# Altium schematic sheet Main.SchDoc
size A3; SheetNumber: 3; SheetTotal: 5
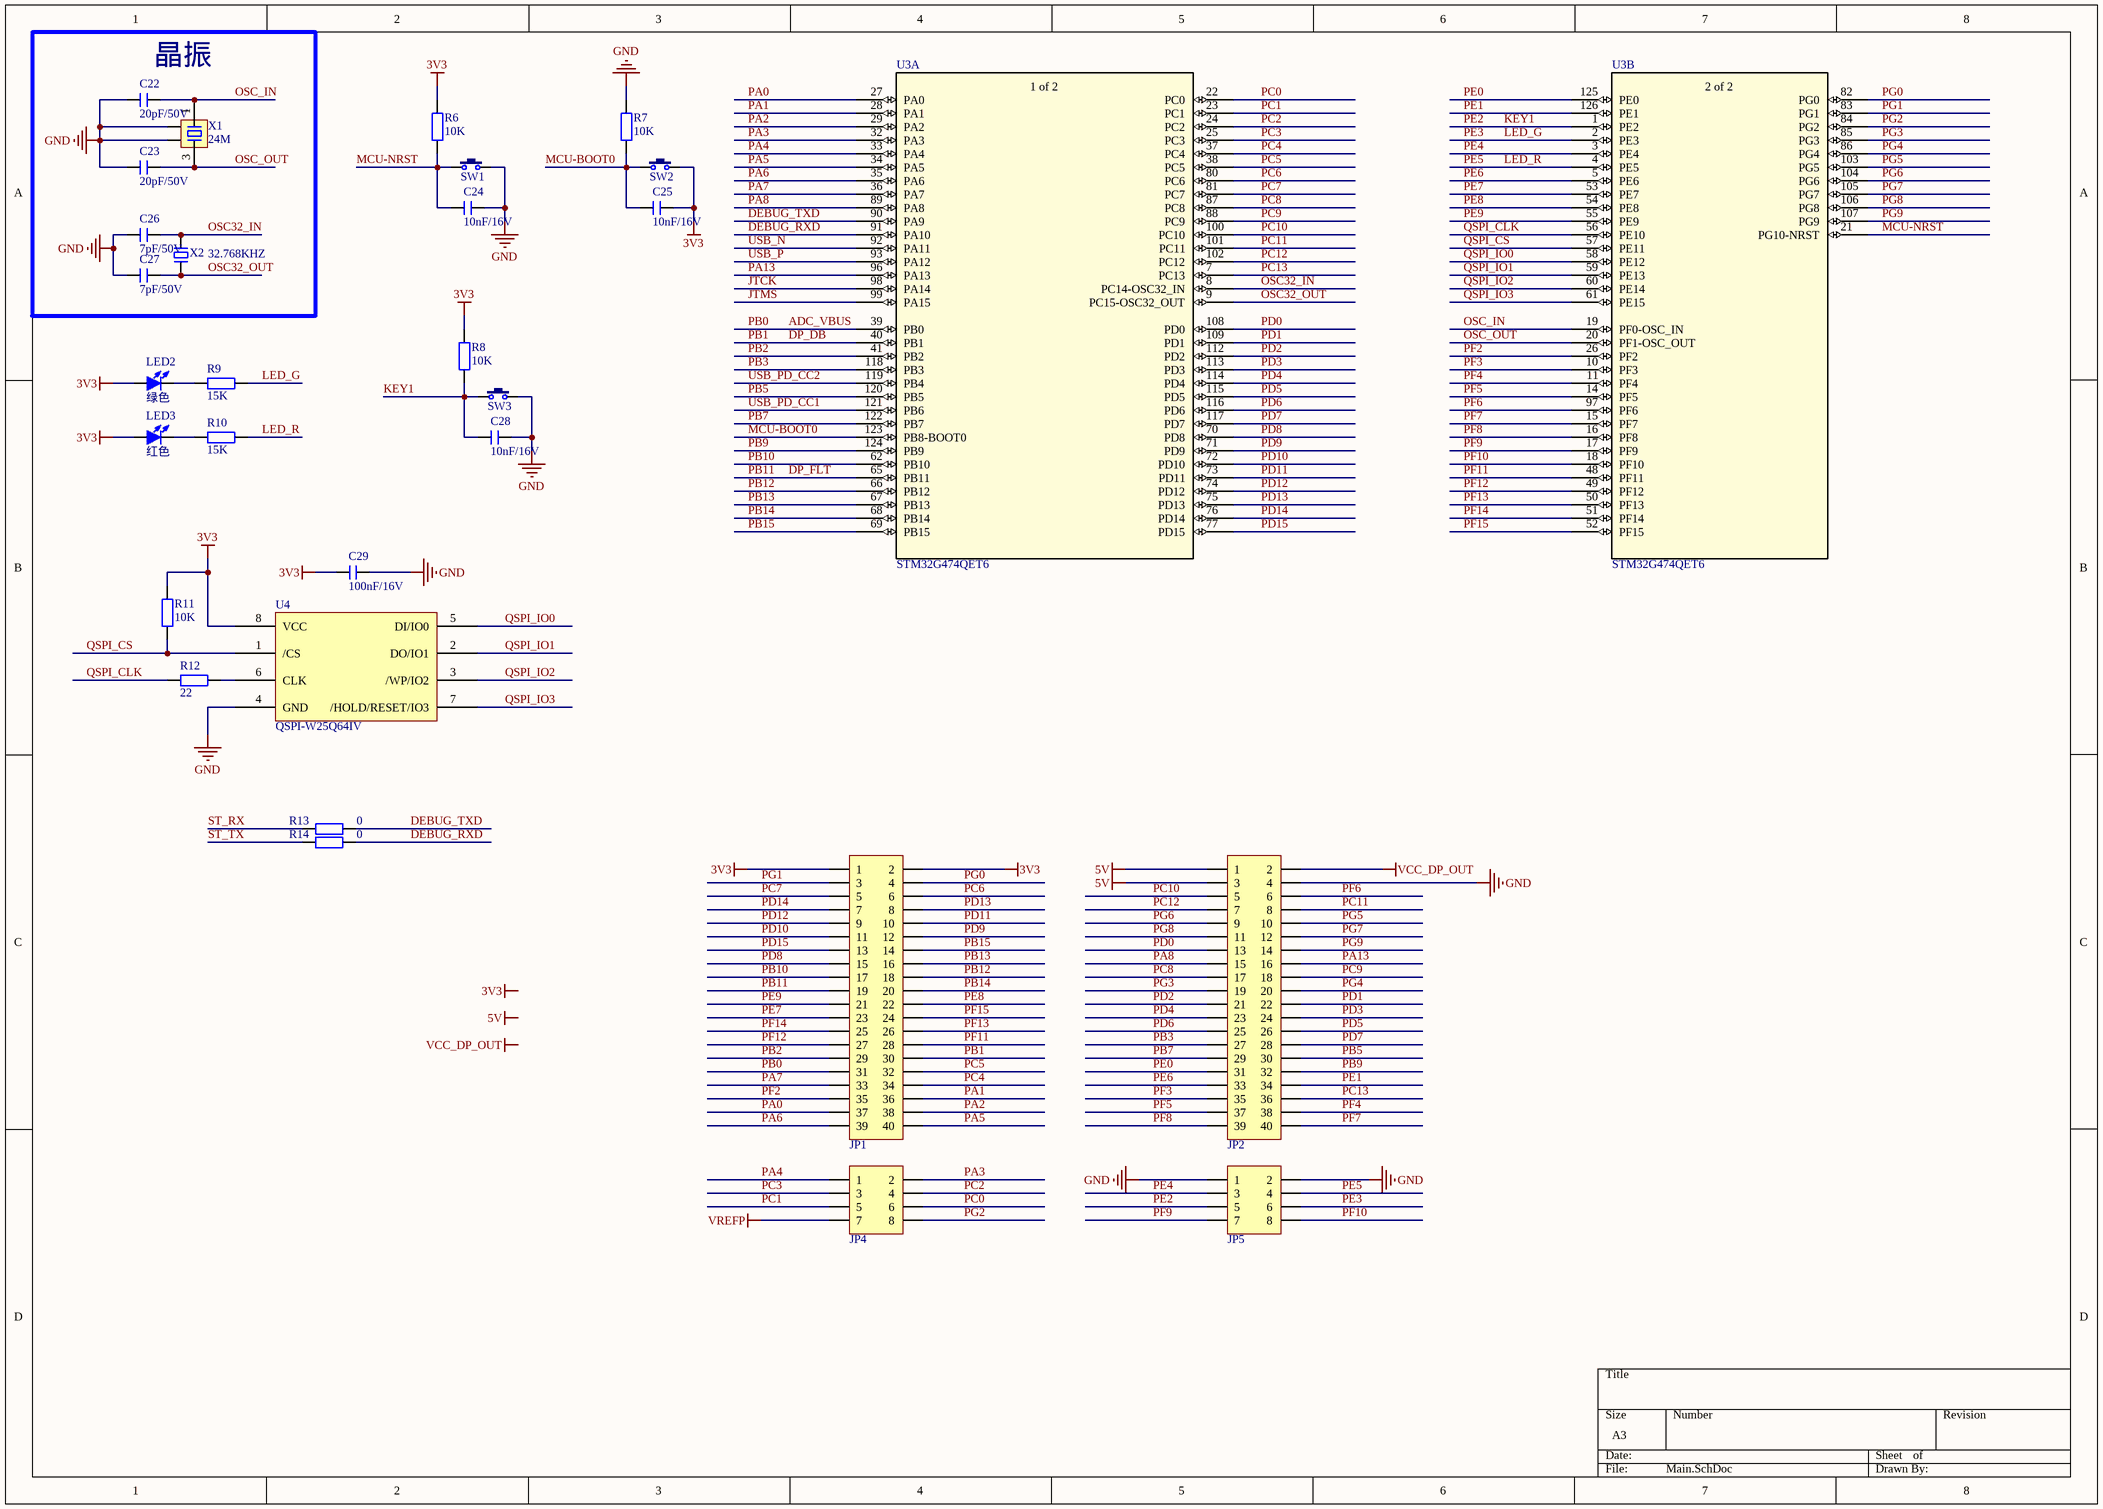
[diagram p0: Main.SchDoc]

## Parts
C22  20pF/50V  [C 0402_L]
C23  20pF/50V  [C 0402_L]
C24  10nF/16V  [C 0402_L]
C25  10nF/16V  [C 0402_L]
C26  7pF/50V  [C 0402_L]
C27  7pF/50V  [C 0402_L]
C28  10nF/16V  [C 0402_L]
C29  100nF/16V  [C 0402_L]
JP1  Header 2X11  [HDR2.54-LI-2x20P]  (value not drawn)
JP2  Header 2X11  [HDR2.54-LI-2x20P]  (value not drawn)
JP4  Header 4X2  [HDR2.54-LI-2x4P]  (value not drawn)
JP5  Header 4X2  [HDR2.54-LI-2x4P]  (value not drawn)
LED2  绿色  [LED]
LED3  红色  [LED]
R6  10K  [R 0402_L]
R7  10K  [R 0402_L]
R8  10K  [R 0402_L]
R9  15K  [R 0402_L]
R10  15K  [R 0402_L]
R11  10K  [R 0402_L]
R12  22  [R 0402_L]
R13  0  [R 0402_L]
R14  0  [R 0402_L]
SW1  3x6x5  [按钮]  (value not drawn)
SW2  3x6x5  [按钮]  (value not drawn)
SW3  3x6x5  [按钮]  (value not drawn)
U3  STM32G474QET6  [LQFP128-14*14]  (parts A,B of 3)
U4  QSPI-W25Q64IV  [SOP8]
X1  24M  [OSC 3225-4P]
X2  32.768KHZ  [OSC 3215-2P]

## Blocks framed on the sheet
晶振: C22 C23 C26 C27 X1 X2

## Nets
3V3: C25.2 C29.2 JP1.1 JP1.2 LED2.1(A) LED3.1(A) R6.2 R8.2 R11.1 SW2.2 U4.8(VCC)
5V: JP2.1 JP2.3
GND: C22.1 C23.1 C24.2 C26.1 C27.1 C28.2 C29.1 JP2.4 JP5.1 JP5.2 R7.2 SW1.2 SW3.2 U4.4(GND) X1.2 X1.4
VCC_DP_OUT: JP2.2
VREFP: JP4.7
ADC_VBUS: JP1.31 U3.39(PB0)  [also labelled PB0]
DEBUG_RXD: R14.2 U3.91(PA10)
DEBUG_TXD: R13.2 U3.90(PA9)
DP_DB: JP1.30 U3.40(PB1)  [also labelled PB1]
DP_FLT: JP1.19 U3.65(PB11)  [also labelled PB11]
JTCK: U3.98(PA14)
JTMS: U3.99(PA15)
KEY1: C28.1 JP5.5 R8.1 SW3.1 U3.1(PE2)  [also labelled PE2]
LED_G: JP5.6 R9.1 U3.2(PE3)  [also labelled PE3]
LED_R: JP5.4 R10.1 U3.4(PE5)  [also labelled PE5]
MCU-BOOT0: C25.1 R7.1 SW2.1 U3.123(PB8-BOOT0)
MCU-NRST: C24.1 R6.1 SW1.1 U3.21(PG10-NRST)
OSC32_IN: C26.2 U3.8(PC14-OSC32_IN) X2.2
OSC32_OUT: C27.2 U3.9(PC15-OSC32_OUT) X2.1
OSC_IN: C22.2 U3.19(PF0-OSC_IN) X1.1
OSC_OUT: C23.2 U3.20(PF1-OSC_OUT) X1.3
PA0: JP1.37 U3.27(PA0)
PA1: JP1.36 U3.28(PA1)
PA2: JP1.38 U3.29(PA2)
PA3: JP4.2 U3.32(PA3)
PA4: JP4.1 U3.33(PA4)
PA5: JP1.40 U3.34(PA5)
PA6: JP1.39 U3.35(PA6)
PA7: JP1.33 U3.36(PA7)
PA8: JP2.15 U3.89(PA8)
PA13: JP2.16 U3.96(PA13)
PB2: JP1.29 U3.41(PB2)
PB3: JP2.27 U3.118(PB3)
PB5: JP2.30 U3.120(PB5)
PB7: JP2.29 U3.122(PB7)
PB9: JP2.32 U3.124(PB9)
PB10: JP1.17 U3.62(PB10)
PB12: JP1.18 U3.66(PB12)
PB13: JP1.16 U3.67(PB13)
PB14: JP1.20 U3.68(PB14)
PB15: JP1.14 U3.69(PB15)
PC0: JP4.6 U3.22(PC0)
PC1: JP4.5 U3.23(PC1)
PC2: JP4.4 U3.24(PC2)
PC3: JP4.3 U3.25(PC3)
PC4: JP1.34 U3.37(PC4)
PC5: JP1.32 U3.38(PC5)
PC6: JP1.6 U3.80(PC6)
PC7: JP1.5 U3.81(PC7)
PC8: JP2.17 U3.87(PC8)
PC9: JP2.18 U3.88(PC9)
PC10: JP2.5 U3.100(PC10)
PC11: JP2.8 U3.101(PC11)
PC12: JP2.7 U3.102(PC12)
PC13: JP2.36 U3.7(PC13)
PD0: JP2.13 U3.108(PD0)
PD1: JP2.22 U3.109(PD1)
PD2: JP2.21 U3.112(PD2)
PD3: JP2.24 U3.113(PD3)
PD4: JP2.23 U3.114(PD4)
PD5: JP2.26 U3.115(PD5)
PD6: JP2.25 U3.116(PD6)
PD7: JP2.28 U3.117(PD7)
PD8: JP1.15 U3.70(PD8)
PD9: JP1.12 U3.71(PD9)
PD10: JP1.11 U3.72(PD10)
PD11: JP1.10 U3.73(PD11)
PD12: JP1.9 U3.74(PD12)
PD13: JP1.8 U3.75(PD13)
PD14: JP1.7 U3.76(PD14)
PD15: JP1.13 U3.77(PD15)
PE0: JP2.31 U3.125(PE0)
PE1: JP2.34 U3.126(PE1)
PE4: JP5.3 U3.3(PE4)
PE6: JP2.33 U3.5(PE6)
PE7: JP1.23 U3.53(PE7)
PE8: JP1.22 U3.54(PE8)
PE9: JP1.21 U3.55(PE9)
PF2: JP1.35 U3.26(PF2)
PF3: JP2.35 U3.10(PF3)
PF4: JP2.38 U3.11(PF4)
PF5: JP2.37 U3.14(PF5)
PF6: JP2.6 U3.97(PF6)
PF7: JP2.40 U3.15(PF7)
PF8: JP2.39 U3.16(PF8)
PF9: JP5.7 U3.17(PF9)
PF10: JP5.8 U3.18(PF10)
PF11: JP1.28 U3.48(PF11)
PF12: JP1.27 U3.49(PF12)
PF13: JP1.26 U3.50(PF13)
PF14: JP1.25 U3.51(PF14)
PF15: JP1.24 U3.52(PF15)
PG0: JP1.4 U3.82(PG0)
PG1: JP1.3 U3.83(PG1)
PG2: JP4.8 U3.84(PG2)
PG3: JP2.19 U3.85(PG3)
PG4: JP2.20 U3.86(PG4)
PG5: JP2.10 U3.103(PG5)
PG6: JP2.9 U3.104(PG6)
PG7: JP2.12 U3.105(PG7)
PG8: JP2.11 U3.106(PG8)
PG9: JP2.14 U3.107(PG9)
QSPI_CLK: R12.1 U3.56(PE10)
QSPI_CS: R11.2 U3.57(PE11) U4.1(/CS)
QSPI_IO0: U3.58(PE12) U4.5(DI/IO0)
QSPI_IO1: U3.59(PE13) U4.2(DO/IO1)
QSPI_IO2: U3.60(PE14) U4.3(/WP/IO2)
QSPI_IO3: U3.61(PE15) U4.7(/HOLD/RESET/IO3)
ST_RX: R13.1
ST_TX: R14.1
USB_N: U3.92(PA11)
USB_P: U3.93(PA12)
USB_PD_CC1: U3.121(PB6)
USB_PD_CC2: U3.119(PB4)
NetLED2_2: LED2.2(K) R9.2
NetLED3_2: LED3.2(K) R10.2
NetR12_2: R12.2 U4.6(CLK)

## Notes on the sheet
- Labels drawn without touching a wire or pin: 3V3, 5V, VCC_DP_OUT
- (in symbol STM32G474QET6, part A) 1 of 2
- (in symbol STM32G474QET6, part B) 2 of 2

## Library data of the parts
C22 C23 = C: 贴片电容; 主类型: 电容; 值精度: ±1%; 元件封装: 0402; 具体类型: 陶瓷电容; 封装类型: 贴片; 温度漂移: NP0; 生产商: YAGEO(国巨); 生产商零件编码: CC0402FRNPO9BN200; 值/型号: 20pF/50V; 立创编号: C327010
C24 C25 C28 = C: 贴片电容; 主类型: 电容; 值精度: ±10%; 元件封装: 0402; 具体类型: 陶瓷电容; 封装类型: 贴片; 温度漂移: X7R; 生产商: YAGEO(国巨); 生产商零件编码: CC0402KRX7R7BB103; 值/型号: 10nF/16V; 立创编号: C327009
C26 C27 = C: 贴片电容; 主类型: 电容; 值精度: ±0.25pF; 元件封装: 0402; 具体类型: 陶瓷电容; 封装类型: 贴片; 温度漂移: C0G; 生产商: YAGEO(国巨); 生产商零件编码: CC0402CRNPO9BN7R0; 值/型号: 7pF/50V; 立创编号: C260628
C29 = C: 贴片电容; 主类型: 电容; 值精度: ±10%; 元件封装: 0402; 具体类型: 陶瓷电容; 封装类型: 贴片; 温度漂移: X7R（15%）; 温度范围: -55°C ~ 125°C; 生产商: YAGEO(国巨); 生产商零件编码: CC0402KRX7R7BB104; 值/型号: 100nF/16V; 立创编号: C60474
JP1 JP2 = Header 20X2: 20*2P接插件; 版权归属: 源创客; BOM名称: 20*2P接插件; 学习资源: www.ooocke.com
JP4 JP5 = Header 4X2: 4*2P接插件; 版权归属: 源创客; BOM名称: 4*2P接插件; 学习资源: www.ooocke.com
LED2 LED3 = LED-SMD: C84267
R6-R8 = R: 贴片电阻
R9 R10 = R: 贴片电阻 0402 5%; 主类型: 电阻; 值精度: ±1%; 元件封装: 0402; 封装类型: 贴片; 温度漂移: 50ppm; 生产商: 国巨; 生产商零件编码: RT0402FRE0715KL; 值/型号: 15K; 具体类型: 贴片电阻; 立创编号: C136975
R11 R12 = R: 贴片电阻 0402 1%; 主类型: 电阻; 值/型号: 100K; 元件封装: 0402; 封装类型: 贴片; 温度漂移: ±100ppm/℃; 生产商: 国巨; 生产商零件编码: RC0402FR-07100KL; 值精度: ±1%; 具体类型: 贴片电阻; 立创编号: C60491
R13 R14 = R: 贴片电阻; 元件封装: 0402; 封装类型: 贴片
SW1-SW3 = TSW 3x6: 3x6轻触开关
U3 = STM32G474QET6: No Description Available
U4 = QSPI-W25Q256IV
X1 = XTAL-4P: 4脚无源晶振; 主类型: 晶振; 值精度: 20PPM; 元件封装: 3225; 具体类型: 无源晶振; 封装类型: 贴片; 温度范围: -40℃~85℃; 生产商: YXC扬兴科技; 生产商零件编码: X322524MSB4SI; 值/型号: 24M; 立创编号: C15643
X2 = XTAL-2P: 2脚无源脚晶振; 主类型: 晶振; 值精度: 10PPM; 元件封装: 3215; 具体类型: 无源晶振; 封装类型: 贴片; 温度范围: -40℃ ~ +85℃; 生产商: EPSON(爱普生); 生产商零件编码: Q13FC1350000200; 值/型号: 32.768K; 立创编号: C48615